# EAGLE schematic isp_hvp_shield (EAGLE 7.7.0)
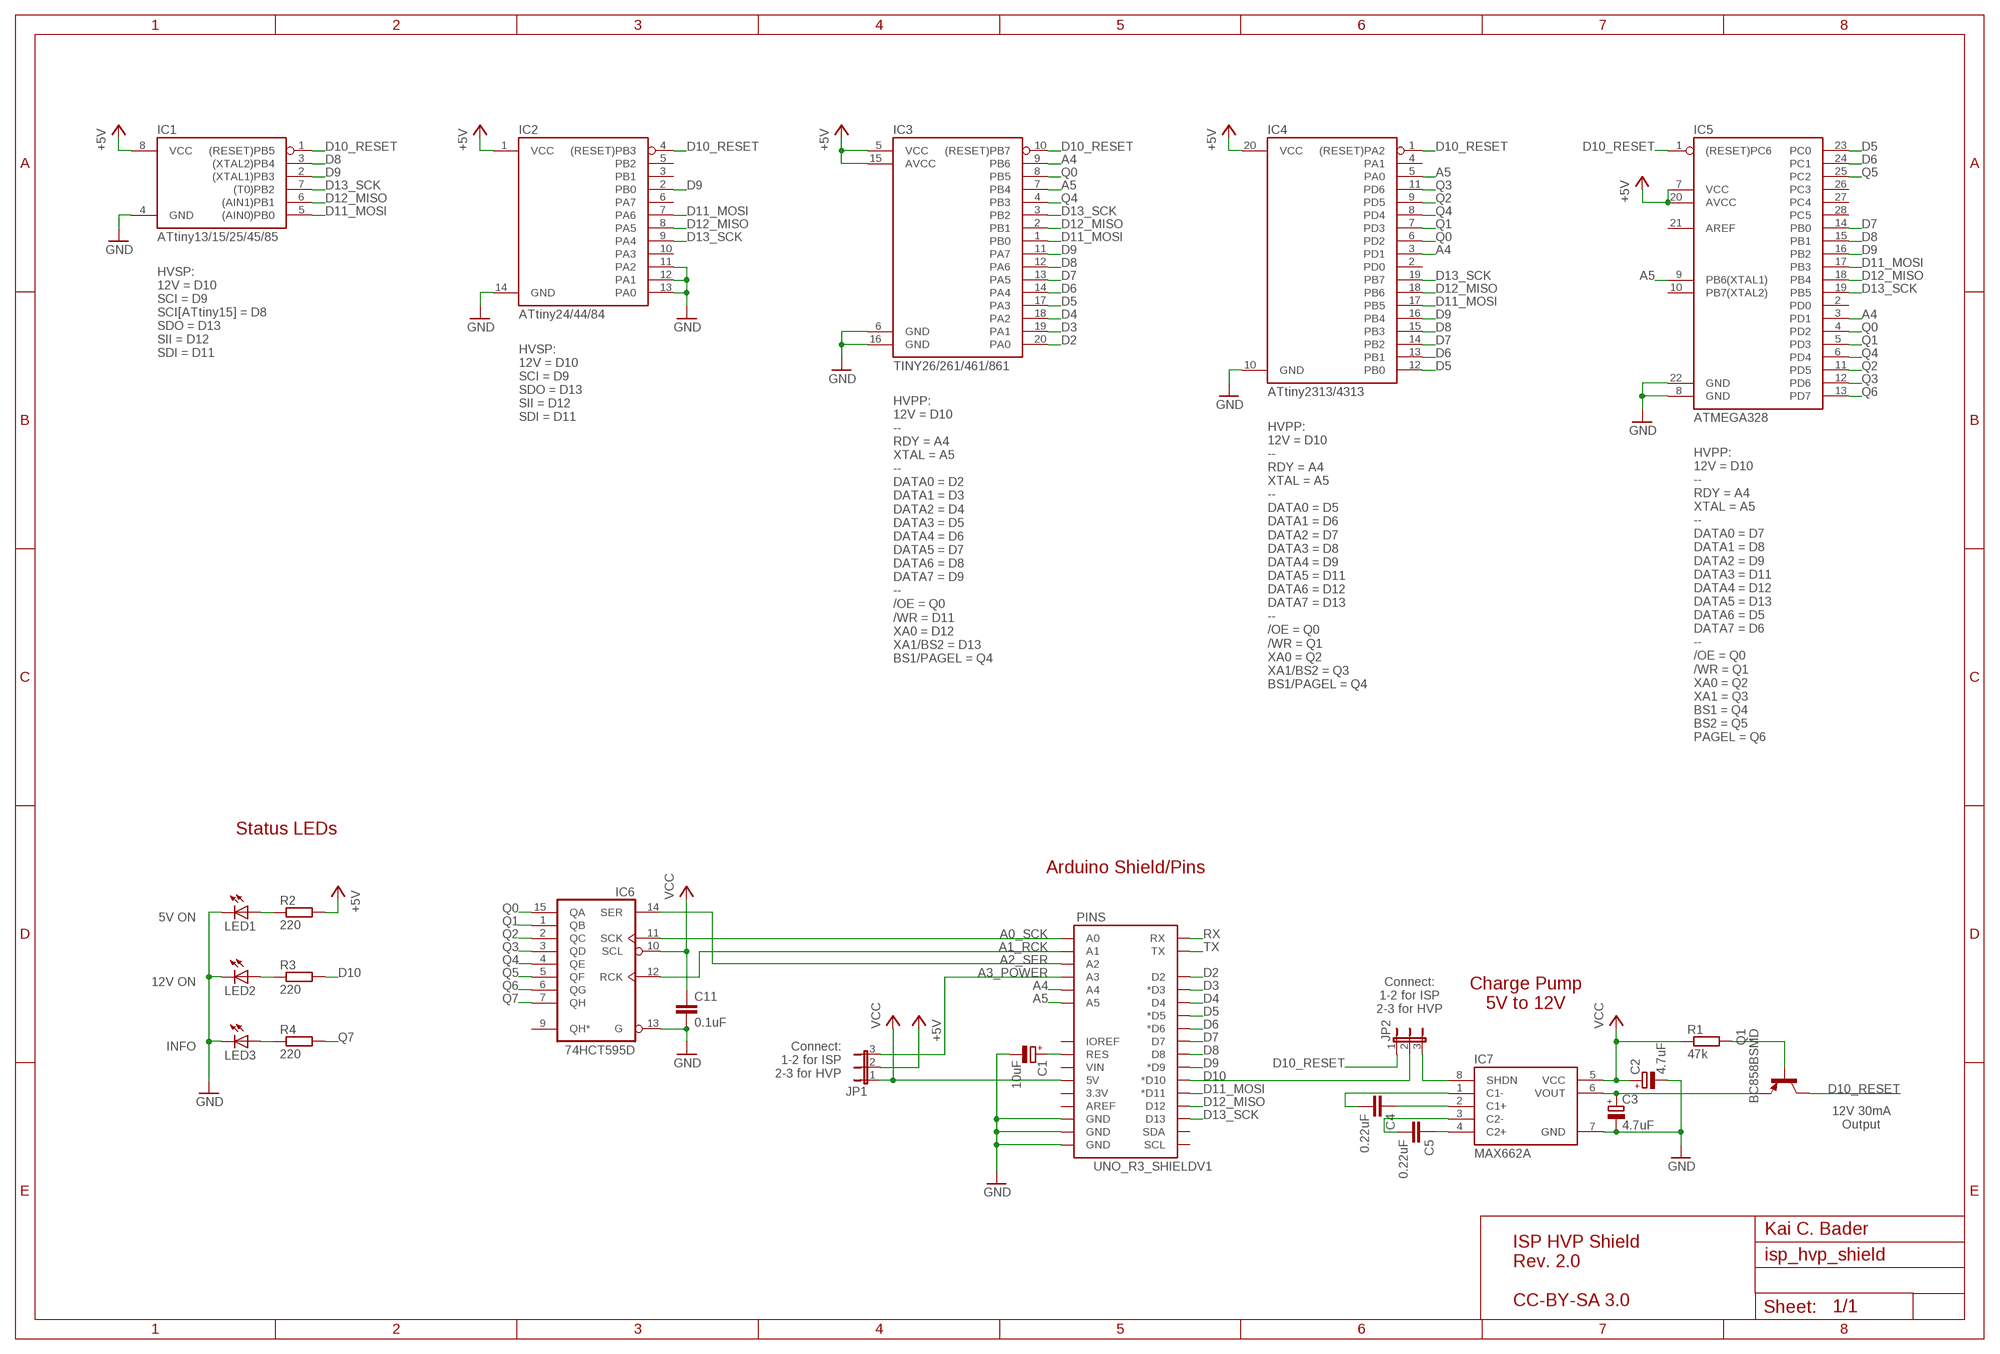
[diagram p0: schematic, sheet 1]

## Parts
C1  10uF  CPOL-EUE2-5  [E2-5]
C2  4.7uF  CPOL-EUE2-5  [E2-5]
C3  4.7uF  CPOL-EUE2-5  [E2-5]
C4  0.22uF  C-EUC0805  [C0805]
C5  0.22uF  C-EUC0805  [C0805]
C11  0.1uF  C-EUC0805  [C0805]
IC1  ATtiny13/15/25/45/85  TINY85P  [DIL08]
IC2  ATtiny24/44/84  TINY84  [DIL14]
IC3  TINY26/261/461/861  TINY26  [DIL20]
IC4  ATtiny2313/4313  TINY2313  [DIL20]
IC5  ATMEGA328  [DIL28]
IC6  74HCT595D  [SO16]
IC7  MAX662A  [SO08]
JP1  JP2E  [JP2]
JP2  JP2E  [JP2]
LED1  LEDCHIPLED_0805  [CHIPLED_0805]
LED2  LEDCHIPLED_0805  [CHIPLED_0805]
LED3  LEDCHIPLED_0805  [CHIPLED_0805]
PINS  UNO_R3_SHIELDV1  [UNO_R3_SHIELD]
Q1  BC858BSMD  [SOT23-BEC]
R1  47k  R-EU_R0805  [R0805]
R2  220  R-EU_R0805  [R0805]
R3  220  R-EU_R0805  [R0805]
R4  220  R-EU_R0805  [R0805]

## Nets
220: LED2.A R3.1
+5V: IC1.8(VCC) IC2.1(VCC) IC3.5(VCC) IC3.15(AVCC) IC4.20(VCC) IC5.7(VCC) IC5.20(AVCC) JP1.2 R2.2
A0_SCK: IC6.11(SCK) PINS.A0
A1_RCK: IC6.12(RCK) PINS.A1
A2_SER: IC6.14(SER) PINS.A2
A3_POWER: JP1.3 PINS.A3
A4: IC3.9(PB6) IC4.3(PD1) IC5.3(PD1) PINS.A4
A5: IC3.7(PB4) IC4.5(PA0) IC5.9(PB6(XTAL1)) PINS.A5
D2: IC3.20(PA0) PINS.D2
D3: IC3.19(PA1) PINS.D3(*D3)
D4: IC3.18(PA2) PINS.D4
D5: IC3.17(PA3) IC4.12(PB0) IC5.23(PC0) PINS.D5(*D5)
D6: IC3.14(PA4) IC4.13(PB1) IC5.24(PC1) PINS.D6(*D6)
D7: IC3.13(PA5) IC4.14(PB2) IC5.14(PB0) PINS.D7
D8: IC1.3((XTAL2)PB4) IC3.12(PA6) IC4.15(PB3) IC5.15(PB1) PINS.D8
D9: IC1.2((XTAL1)PB3) IC2.2(PB0) IC3.11(PA7) IC4.16(PB4) IC5.16(PB2) PINS.D9(*D9)
D10: JP2.2 PINS.D10(*D10) R3.2
D10_RESET: IC1.1((RESET)PB5) IC2.4((RESET)PB3) IC3.10((RESET)PB7) IC4.1((RESET)PA2) IC5.1((RESET)PC6) JP2.1 Q1.C
D11_MOSI: IC1.5((AIN0)PB0) IC2.7(PA6) IC3.1(PB0) IC4.17(PB5) IC5.17(PB3) PINS.D11(*D11)
D12_MISO: IC1.6((AIN1)PB1) IC2.8(PA5) IC3.2(PB1) IC4.18(PB6) IC5.18(PB4) PINS.D12
D13_SCK: IC1.7((T0)PB2) IC2.9(PA4) IC3.3(PB2) IC4.19(PB7) IC5.19(PB5) PINS.D13
GND: C1.- C2.- C3.- C11.2 IC1.4(GND) IC2.11(PA2) IC2.12(PA1) IC2.13(PA0) IC2.14(GND) IC3.6(GND) IC3.16(GND) IC4.10(GND) IC5.8(GND) IC5.22(GND) IC6.13(G) IC7.7(GND) LED1.C LED2.C LED3.C PINS.GND@0(GND) PINS.GND@1(GND) PINS.GND@2(GND)
N$1: IC7.8(SHDN) JP2.3
N$2: C1.+ PINS.RES
N$3: Q1.B R1.2
N$4: C5.1 IC7.4(C2+)
N$5: C5.2 IC7.3(C2-)
N$6: C4.1 IC7.2(C1+)
N$7: C4.2 IC7.1(C1-)
N$8: LED1.A R2.1
N$10: LED3.A R4.1
Q0: IC3.8(PB5) IC4.6(PD2) IC5.4(PD2) IC6.15(QA)
Q1: IC4.7(PD3) IC5.5(PD3) IC6.1(QB)
Q2: IC4.9(PD5) IC5.11(PD5) IC6.2(QC)
Q3: IC4.11(PD6) IC5.12(PD6) IC6.3(QD)
Q4: IC3.4(PB3) IC4.8(PD4) IC5.6(PD4) IC6.4(QE)
Q5: IC5.25(PC2) IC6.5(QF)
Q6: IC5.13(PD7) IC6.6(QG)
Q7: IC6.7(QH) R4.2
RX: PINS.RX
TX: PINS.TX
VCC: C2.+ C11.1 IC6.10(SCL) IC7.5(VCC) JP1.1 PINS.5V R1.1
VOUT: C3.+ IC7.6(VOUT) Q1.E
Unconnected: IC2.3(PB1) IC2.5(PB2) IC2.6(PA7) IC2.10(PA3) IC4.2(PD0) IC4.4(PA1) IC5.2(PD0) IC5.10(PB7(XTAL2)) IC5.26(PC3) IC5.27(PC4) IC5.28(PC5) IC6.9(QH*) PINS.3.3V PINS.AREF PINS.IOREF PINS.SCL PINS.SDA PINS.VIN

## Notes on the sheet
- HVSP:
  12V = D10
  SCI = D9
  SCI[ATtiny15] = D8
  SDO = D13
  SII = D12
  SDI = D11
- HVSP:
  12V = D10
  SCI = D9
  SDO = D13
  SII = D12
  SDI = D11
- HVPP:
  12V = D10
  --
  RDY = A4
  XTAL = A5
  --
  DATA0 = D2
  DATA1 = D3
  DATA2 = D4
  DATA3 = D5
  DATA4 = D6
  DATA5 = D7
  DATA6 = D8
  DATA7 = D9
  --
  /OE = Q0
  /WR = D11
  XA0 = D12
  XA1/BS2 = D13
  BS1/PAGEL = Q4
- HVPP:
  12V = D10
  --
  RDY = A4
  XTAL = A5
  --
  DATA0 = D5
  DATA1 = D6
  DATA2 = D7
  DATA3 = D8
  DATA4 = D9
  DATA5 = D11
  DATA6 = D12
  DATA7 = D13
  --
  /OE = Q0
  /WR = Q1
  XA0 = Q2
  XA1/BS2 = Q3
  BS1/PAGEL = Q4
- HVPP:
  12V = D10
  --
  RDY = A4
  XTAL = A5
  --
  DATA0 = D7
  DATA1 = D8
  DATA2 = D9
  DATA3 = D11
  DATA4 = D12
  DATA5 = D13
  DATA6 = D5
  DATA7 = D6
  --
  /OE = Q0
  /WR = Q1
  XA0 = Q2
  XA1 = Q3
  BS1 = Q4
  BS2 = Q5
  PAGEL = Q6
- Status LEDs
- Arduino Shield/Pins
- 5V ON
- 12V ON
- Connect:
  1-2 for ISP
  2-3 for HVP
- Charge Pump
  5V to 12V
- INFO
- Connect:
  1-2 for ISP
  2-3 for HVP
- 12V 30mA
  Output
- Kai C. Bader
- ISP HVP Shield
  Rev. 2.0
  
  CC-BY-SA 3.0

## Power pins joined to a net without a drawn wire
AREF: IC5.21(AREF)
GND: IC6.8(GND)
VCC: IC6.16(VCC)

## Library data of the parts
C1-C3 = rcl:CPOL-EU: POLARIZED CAPACITOR, European symbol
C4 C5 C11 = rcl:C-EU: CAPACITOR, European symbol
IC1 = kaibader:TINY85: ATtiny85 8-bit AVR Microcontroller, 8KB Flash Pin-compatible to ATtiny25, ATtiny45; OC_FARNELL: unknown; OC_NEWARK: unknown
IC2 = kaibader:TINY84: ATtiny84 8-bit AVR Microcontroller, 8KB Flash Pin-compatible to ATtiny24, ATtiny44
IC3 = kaibader:TINY26: ATtiny26
IC4 = kaibader:TINY2313: ATtiny2313 8-bit AVR Microcontroller, 2KB Flash Pin-compatible to ATtiny4313
IC5 = kaibader:ATMEGA328: ATmega328P
IC6 = 74xx-eu:74*595: 8-bit SHIFT REGISTER, output latch
IC7 = kaibader:MAX662A: MAX662A / ST662A MAXIM +12V, 30mA Flash Memory Programming Supply
JP1 JP2 = jumper:JP2E: JUMPER
LED1-LED3 = led:LED: LED OSRAM: - CHIPLED LG R971, LG N971, LY N971, LG Q971, LY Q971, LO R971, LY R971 LH N974, LH R974 LS Q976, LO Q976, LY Q976 LO Q996 - Hyper CHIPLED LW Q18S LB Q993, LB Q99A, LB R99A - SideLED LS A670, LO A670, LY A670, LG A670, LP A670 LB A673, LV A673, LT A673, LW A673 LH A674 LY A675 LS A676, LA A676, LO A676, LY A676, LW A676 LS A679, LY A679, LG A679 - Hyper Micro SIDELED® LS Y876, LA Y876, LO Y876, LY Y876 LT Y87S - SmartLED LW L88C, LW L88S LB L89C, LB L89S, LG L890 LS L89K, LO L89K, LY L89K LS L896, LA L896, LO L896, LY L896 - TOPLED LS T670, LO T670, LY T670, LG T670, LP T670 LSG T670, LSP T670, LSY T670, LOP T670, LYG T670 LG T671, LOG T671, LSG T671 LB T673, LV T673, LT T673, LW T673 LH T674 LS T676, LA T676, LO T676, LY T676, LB T676, LH T676, LSB T676, LW T676 LB T67C, LV T67C, LT T67C, LS T67K, LO T67K, LY T67K, LW E67C LS E67B, LA E67B, LO E67B, LY E67B, LB E67C, LV E67C, LT E67C LW T67C LS T679, LY T679, LG T679 LS T770, LO T770, LY T770, LG T770, LP T770 LB T773, LV T773, LT T773, LW T773 LH T774 LS E675, LA E675, LY E675, LS T675 LS T776, LA T776, LO T776, LY T776, LB T776 LHGB T686 LT T68C, LB T68C - Hyper Mini TOPLED® LB M676 - Mini TOPLED Santana® LG M470 LS M47K, LO M47K, LY M47K Source: http://www.osram.convergy.de LUXEON: - LUMILED® LXK2-PW12-R00, LXK2-PW12-S00, LXK2-PW14-U00, LXK2-PW14-V00 LXK2-PM12-R00, LXK2-PM12-S00, LXK2-PM14-U00 LXK2-PE12-Q00, LXK2-PE12-R00, LXK2-PE12-S00, LXK2-PE14-T00, LXK2-PE14-U00 LXK2-PB12-K00, LXK2-PB12-L00, LXK2-PB12-M00, LXK2-PB14-N00, LXK2-PB14-P00, LXK2-PB14-Q00 LXK2-PR12-L00, LXK2-PR12-M00, LXK2-PR14-Q00, LXK2-PR14-R00 LXK2-PD12-Q00, LXK2-PD12-R00, LXK2-PD12-S00 LXK2-PH12-R00, LXK2-PH12-S00 LXK2-PL12-P00, LXK2-PL12-Q00, LXK2-PL12-R00 Source: www.luxeon.com KINGBRIGHT: KA-3528ASYC Source: www.kingbright.com
PINS = kaibader:UNO_R3_SHIELD: Shield form compatible with the Arduino Uno R3.
Q1 = transistor-pnp:BC858*: PNP Transistror
R1-R4 = rcl:R-EU_: RESISTOR, European symbol